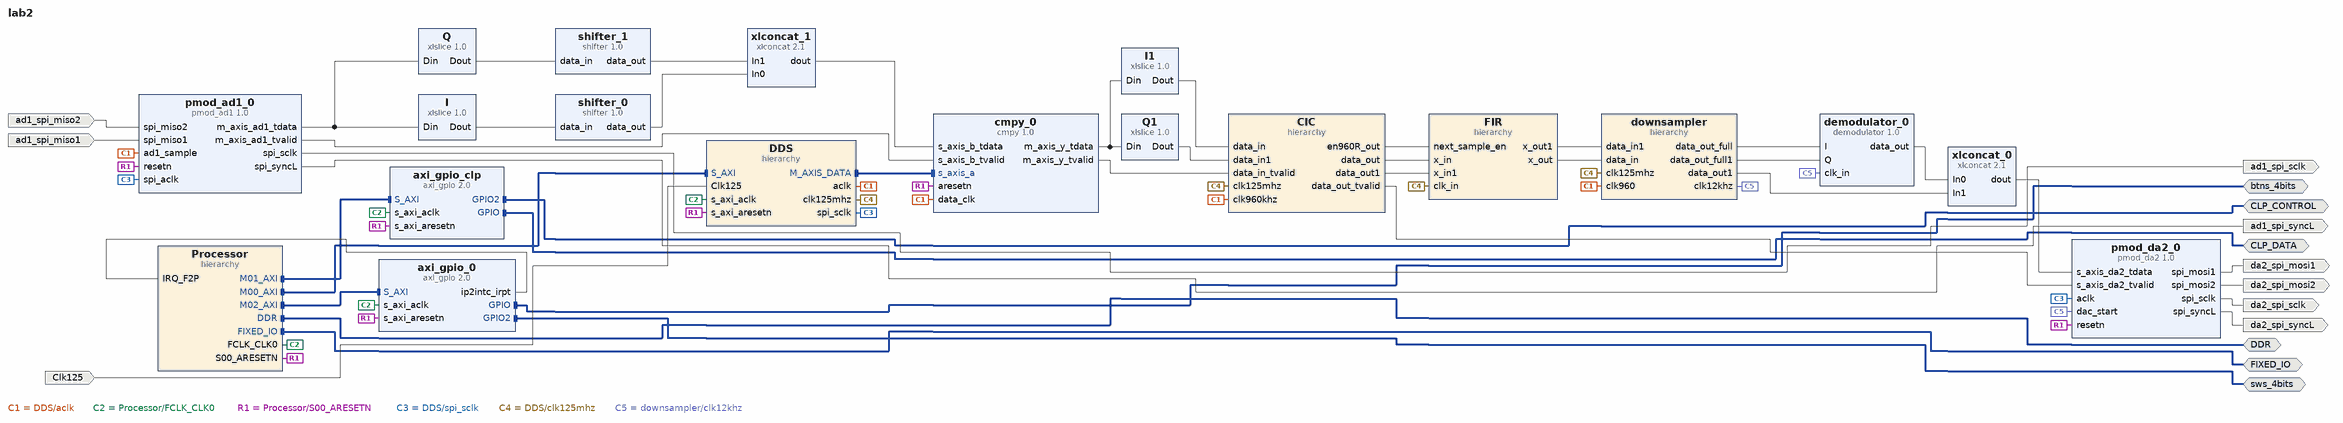
[diagram p0: block diagram of the top level]
# Vivado block design lab2, Vivado 2016.1
create_bd_design lab2

create_bd_intf_port -mode Master -vlnv xilinx.com:interface:ddrx_rtl:1.0 DDR
create_bd_intf_port -mode Master -vlnv xilinx.com:display_processing_system7:fixedio_rtl:1.0 FIXED_IO
create_bd_intf_port -mode Master -vlnv xilinx.com:interface:gpio_rtl:1.0 CLP_CONTROL
create_bd_intf_port -mode Master -vlnv xilinx.com:interface:gpio_rtl:1.0 CLP_DATA
create_bd_intf_port -mode Master -vlnv xilinx.com:interface:gpio_rtl:1.0 btns_4bits
create_bd_intf_port -mode Master -vlnv xilinx.com:interface:gpio_rtl:1.0 sws_4bits
create_bd_port -dir I Clk125
create_bd_port -dir O da2_spi_sclk
create_bd_port -dir O da2_spi_syncL
create_bd_port -dir O da2_spi_mosi1
create_bd_port -dir O da2_spi_mosi2
create_bd_port -dir I ad1_spi_miso2
create_bd_port -dir I ad1_spi_miso1
create_bd_port -dir O ad1_spi_sclk
create_bd_port -dir O ad1_spi_syncL

create_bd_cell -type ip -vlnv dartmouth.edu:user:pmod_da2:1.0 pmod_da2_0
create_bd_cell -type hier Processor
create_bd_cell -type hier DDS
create_bd_cell -type ip -vlnv xilinx.com:ip:axi_gpio:2.0 axi_gpio_clp
set_property -dict [list \
  CONFIG.C_GPIO_WIDTH 8 \
  CONFIG.C_GPIO2_WIDTH 4 \
  CONFIG.C_IS_DUAL 1 \
  CONFIG.C_ALL_OUTPUTS_2 1 \
] [get_bd_cells axi_gpio_clp]
create_bd_cell -type ip -vlnv xilinx.com:ip:axi_gpio:2.0 axi_gpio_0
set_property -dict [list \
  CONFIG.C_INTERRUPT_PRESENT 1 \
  CONFIG.USE_BOARD_FLOW true \
  CONFIG.GPIO_BOARD_INTERFACE btns_4bits \
  CONFIG.GPIO2_BOARD_INTERFACE sws_4bits \
] [get_bd_cells axi_gpio_0]
create_bd_cell -type ip -vlnv dartmouth.edu:user:pmod_ad1:1.0 pmod_ad1_0
create_bd_cell -type ip -vlnv dartmouth.edu:user:cmpy:1.0 cmpy_0
set_property -dict {CONFIG.B_WIDTH 16 CONFIG.Y_WIDTH 16 CONFIG.Y_TDATA_WIDTH 32} [get_bd_cells cmpy_0]
create_bd_cell -type ip -vlnv xilinx.com:ip:xlslice:1.0 I1
set_property -dict {CONFIG.DOUT_WIDTH 16 CONFIG.DIN_FROM 15} [get_bd_cells I1]
create_bd_cell -type ip -vlnv xilinx.com:ip:xlslice:1.0 Q1
set_property -dict {CONFIG.DOUT_WIDTH 16 CONFIG.DIN_TO 16 CONFIG.DIN_FROM 31} [get_bd_cells Q1]
create_bd_cell -type hier CIC
create_bd_cell -type hier FIR
create_bd_cell -type hier downsampler
create_bd_cell -type ip -vlnv xilinx.com:ip:xlconcat:2.1 xlconcat_0
set_property -dict {CONFIG.IN0_WIDTH 16 CONFIG.IN1_WIDTH 16} [get_bd_cells xlconcat_0]
create_bd_cell -type ip -vlnv xilinx.com:ip:xlslice:1.0 I
set_property -dict {CONFIG.DOUT_WIDTH 16 CONFIG.DIN_FROM 15} [get_bd_cells I]
create_bd_cell -type ip -vlnv xilinx.com:ip:xlslice:1.0 Q
set_property -dict {CONFIG.DOUT_WIDTH 16 CONFIG.DIN_TO 16 CONFIG.DIN_FROM 31} [get_bd_cells Q]
create_bd_cell -type ip -vlnv xilinx.com:ip:xlconcat:2.1 xlconcat_1
set_property -dict {CONFIG.IN0_WIDTH 16 CONFIG.IN1_WIDTH 16} [get_bd_cells xlconcat_1]
create_bd_cell -type ip -vlnv dartmouth.edu:user:shifter:1.0 shifter_0
create_bd_cell -type ip -vlnv dartmouth.edu:user:shifter:1.0 shifter_1
create_bd_cell -type ip -vlnv dartmouth.edu:user:demodulator:1.0 demodulator_0

# ---- hierarchy /Processor ----
current_bd_instance /Processor
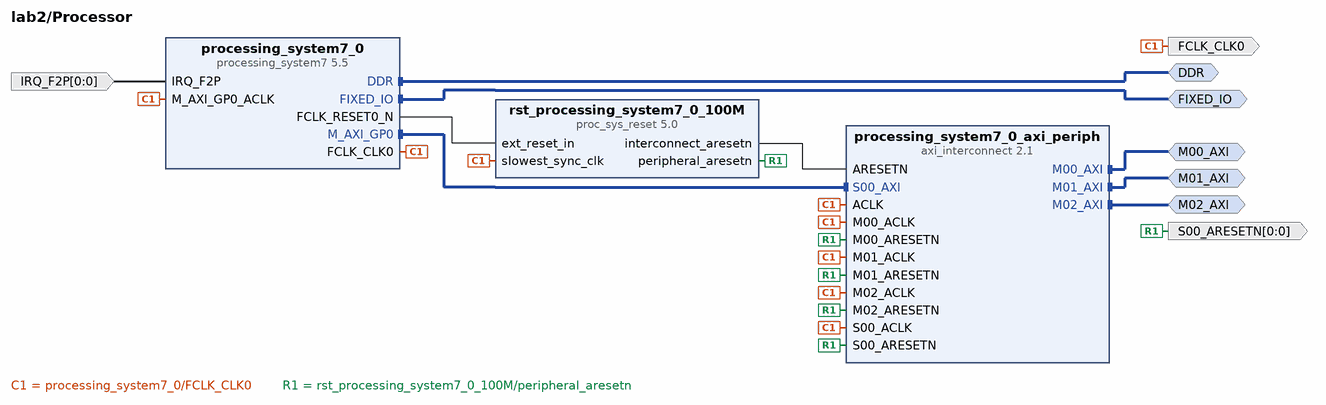
[diagram p1: block diagram inside /Processor]
create_bd_intf_pin -mode Master -vlnv xilinx.com:interface:ddrx_rtl:1.0 DDR
create_bd_intf_pin -mode Master -vlnv xilinx.com:display_processing_system7:fixedio_rtl:1.0 FIXED_IO
create_bd_intf_pin -mode Master -vlnv xilinx.com:interface:aximm_rtl:1.0 M00_AXI
create_bd_intf_pin -mode Master -vlnv xilinx.com:interface:aximm_rtl:1.0 M01_AXI
create_bd_intf_pin -mode Master -vlnv xilinx.com:interface:aximm_rtl:1.0 M02_AXI
create_bd_pin -dir O -type clk FCLK_CLK0
create_bd_pin -dir O -from 0 -to 0 -type rst S00_ARESETN
create_bd_pin -dir I -from 0 -to 0 -type intr IRQ_F2P

create_bd_cell -type ip -vlnv xilinx.com:ip:processing_system7:5.5 processing_system7_0
set_property -dict [list \
  CONFIG.PCW_UIPARAM_DDR_FREQ_MHZ 525 \
  CONFIG.PCW_CRYSTAL_PERIPHERAL_FREQMHZ 50.000000 \
  CONFIG.PCW_APU_PERIPHERAL_FREQMHZ 650 \
  CONFIG.PCW_SDIO_PERIPHERAL_FREQMHZ 50 \
  CONFIG.PCW_FPGA0_PERIPHERAL_FREQMHZ 100 \
  CONFIG.PCW_USE_FABRIC_INTERRUPT 1 \
  CONFIG.PCW_IRQ_F2P_INTR 1 \
  CONFIG.PCW_PRESET_BANK1_VOLTAGE {LVCMOS 1.8V} \
  CONFIG.PCW_UIPARAM_DDR_PARTNO {MT41K128M16 JT-125} \
  CONFIG.PCW_QSPI_PERIPHERAL_ENABLE 1 \
  CONFIG.PCW_QSPI_GRP_SINGLE_SS_ENABLE 1 \
  CONFIG.PCW_QSPI_GRP_FBCLK_ENABLE 1 \
  CONFIG.PCW_ENET0_PERIPHERAL_ENABLE 1 \
  CONFIG.PCW_ENET0_ENET0_IO {MIO 16 .. 27} \
  CONFIG.PCW_ENET0_GRP_MDIO_ENABLE 1 \
  CONFIG.PCW_ENET0_RESET_ENABLE 0 \
  CONFIG.PCW_SD0_PERIPHERAL_ENABLE 1 \
  CONFIG.PCW_SD0_GRP_CD_ENABLE 1 \
  CONFIG.PCW_SD0_GRP_CD_IO {MIO 47} \
  CONFIG.PCW_SD0_GRP_WP_ENABLE 1 \
  CONFIG.PCW_UART1_PERIPHERAL_ENABLE 1 \
  CONFIG.PCW_TTC0_PERIPHERAL_ENABLE 1 \
  CONFIG.PCW_USB0_PERIPHERAL_ENABLE 1 \
  CONFIG.PCW_USB0_RESET_ENABLE 1 \
  CONFIG.PCW_USB0_RESET_IO {MIO 46} \
  CONFIG.PCW_GPIO_MIO_GPIO_ENABLE 1 \
] [get_bd_cells processing_system7_0]
# 105 more settings of processing_system7_0 are not shown: defaults, MIO pin electricals, DDR timing, and values the tool derives
create_bd_cell -type ip -vlnv xilinx.com:ip:proc_sys_reset:5.0 rst_processing_system7_0_100M
create_bd_cell -type ip -vlnv xilinx.com:ip:axi_interconnect:2.1 processing_system7_0_axi_periph
set_property -dict {CONFIG.NUM_MI 3} [get_bd_cells processing_system7_0_axi_periph]

# ---- hierarchy /DDS ----
current_bd_instance /DDS
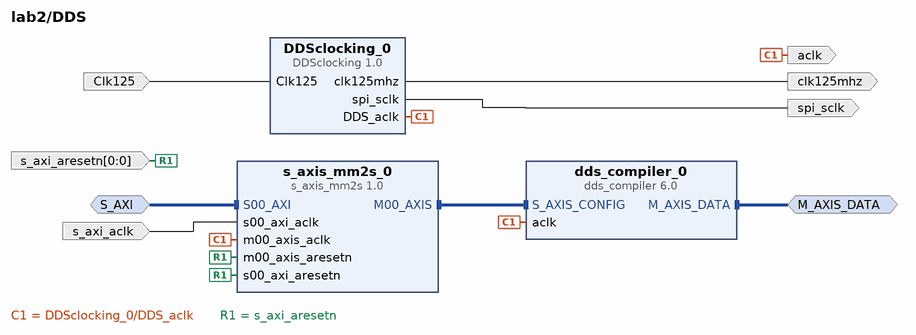
[diagram p2: block diagram inside /DDS]
create_bd_intf_pin -mode Master -vlnv xilinx.com:interface:axis_rtl:1.0 M_AXIS_DATA
create_bd_intf_pin -mode Slave -vlnv xilinx.com:interface:aximm_rtl:1.0 S_AXI
create_bd_pin -dir I Clk125
create_bd_pin -dir O spi_sclk
create_bd_pin -dir O -type clk aclk
create_bd_pin -dir I -type clk s_axi_aclk
create_bd_pin -dir I -from 0 -to 0 -type rst s_axi_aresetn
create_bd_pin -dir O clk125mhz

create_bd_cell -type ip -vlnv xilinx.com:ip:dds_compiler:6.0 dds_compiler_0
set_property -dict [list \
  CONFIG.DDS_Clock_Rate .96 \
  CONFIG.Parameter_Entry Hardware_Parameters \
  CONFIG.Spurious_Free_Dynamic_Range 45 \
  CONFIG.Frequency_Resolution 0.4 \
  CONFIG.Noise_Shaping None \
  CONFIG.Phase_Width 32 \
  CONFIG.Output_Width 12 \
  CONFIG.Phase_Increment Programmable \
  CONFIG.Negative_Sine true \
  CONFIG.Has_Phase_Out false \
  CONFIG.DATA_Has_TLAST Not_Required \
  CONFIG.Has_TREADY false \
  CONFIG.S_PHASE_Has_TUSER Not_Required \
  CONFIG.M_DATA_Has_TUSER Not_Required \
  CONFIG.Latency 7 \
  CONFIG.Output_Frequency1 0 \
  CONFIG.PINC1 10101010101010 \
] [get_bd_cells dds_compiler_0]
create_bd_cell -type ip -vlnv dartmouth.edu:user:s_axis_mm2s:1.0 s_axis_mm2s_0
create_bd_cell -type ip -vlnv dartmouth.edu:user:DDSclocking:1.0 DDSclocking_0

# ---- hierarchy /CIC ----
current_bd_instance /CIC
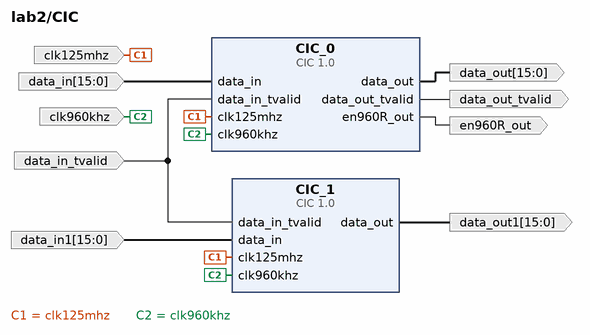
[diagram p3: block diagram inside /CIC]
create_bd_pin -dir I -from 15 -to 0 data_in
create_bd_pin -dir I -from 15 -to 0 data_in1
create_bd_pin -dir I data_in_tvalid
create_bd_pin -dir I clk125mhz
create_bd_pin -dir I clk960khz
create_bd_pin -dir O en960R_out
create_bd_pin -dir O -from 15 -to 0 data_out
create_bd_pin -dir O -from 15 -to 0 data_out1
create_bd_pin -dir O data_out_tvalid

create_bd_cell -type ip -vlnv dartmouth.edu:user:CIC:1.0 CIC_1
create_bd_cell -type ip -vlnv dartmouth.edu:user:CIC:1.0 CIC_0

# ---- hierarchy /FIR ----
current_bd_instance /FIR
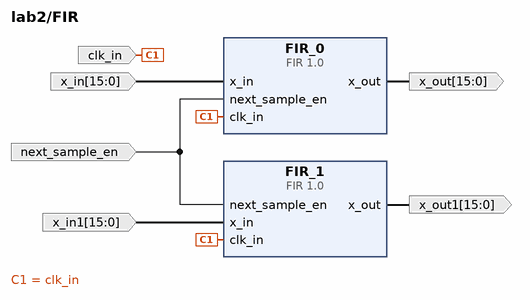
[diagram p4: block diagram inside /FIR]
create_bd_pin -dir I next_sample_en
create_bd_pin -dir I -from 15 -to 0 x_in
create_bd_pin -dir I clk_in
create_bd_pin -dir I -from 15 -to 0 x_in1
create_bd_pin -dir O -from 15 -to 0 x_out
create_bd_pin -dir O -from 15 -to 0 x_out1

create_bd_cell -type ip -vlnv dartmouth.edu:user:FIR:1.0 FIR_0
set_property -dict {CONFIG.DATA_OUT_WIDTH 16} [get_bd_cells FIR_0]
create_bd_cell -type ip -vlnv dartmouth.edu:user:FIR:1.0 FIR_1
set_property -dict {CONFIG.DATA_OUT_WIDTH 16} [get_bd_cells FIR_1]

# ---- hierarchy /downsampler ----
current_bd_instance /downsampler
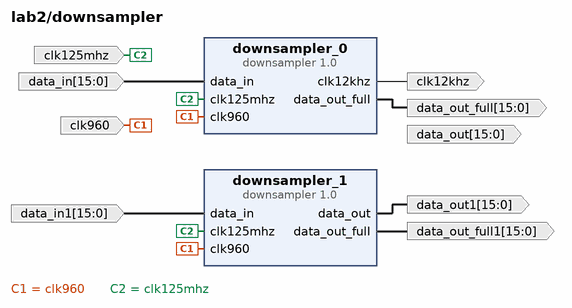
[diagram p5: block diagram inside /downsampler]
create_bd_pin -dir I -from 15 -to 0 data_in
create_bd_pin -dir I clk960
create_bd_pin -dir I clk125mhz
create_bd_pin -dir I -from 15 -to 0 data_in1
create_bd_pin -dir O -from 15 -to 0 data_out
create_bd_pin -dir O -from 15 -to 0 data_out1
create_bd_pin -dir O clk12khz
create_bd_pin -dir O -from 15 -to 0 data_out_full
create_bd_pin -dir O -from 15 -to 0 data_out_full1

create_bd_cell -type ip -vlnv dartmouth.edu:user:downsampler:1.0 downsampler_0
create_bd_cell -type ip -vlnv dartmouth.edu:user:downsampler:1.0 downsampler_1

# ---- connections ----

current_bd_instance /Processor
connect_bd_intf_net [get_bd_intf_pins processing_system7_0/M_AXI_GP0] [get_bd_intf_pins processing_system7_0_axi_periph/S00_AXI]
connect_bd_intf_net [get_bd_intf_pins DDR] [get_bd_intf_pins processing_system7_0/DDR]
connect_bd_intf_net [get_bd_intf_pins FIXED_IO] [get_bd_intf_pins processing_system7_0/FIXED_IO]
connect_bd_intf_net [get_bd_intf_pins M00_AXI] [get_bd_intf_pins processing_system7_0_axi_periph/M00_AXI]
connect_bd_intf_net [get_bd_intf_pins M01_AXI] [get_bd_intf_pins processing_system7_0_axi_periph/M01_AXI]
connect_bd_intf_net [get_bd_intf_pins M02_AXI] [get_bd_intf_pins processing_system7_0_axi_periph/M02_AXI]
connect_bd_net [get_bd_pins processing_system7_0/FCLK_RESET0_N] [get_bd_pins rst_processing_system7_0_100M/ext_reset_in]
connect_bd_net [get_bd_pins rst_processing_system7_0_100M/interconnect_aresetn] [get_bd_pins processing_system7_0_axi_periph/ARESETN]
connect_bd_net [get_bd_pins processing_system7_0/FCLK_CLK0] \
  [get_bd_pins FCLK_CLK0] [get_bd_pins rst_processing_system7_0_100M/slowest_sync_clk] \
  [get_bd_pins processing_system7_0/M_AXI_GP0_ACLK] [get_bd_pins processing_system7_0_axi_periph/S00_ACLK] \
  [get_bd_pins processing_system7_0_axi_periph/ACLK] [get_bd_pins processing_system7_0_axi_periph/M00_ACLK] \
  [get_bd_pins processing_system7_0_axi_periph/M01_ACLK] [get_bd_pins processing_system7_0_axi_periph/M02_ACLK]
connect_bd_net [get_bd_pins rst_processing_system7_0_100M/peripheral_aresetn] \
  [get_bd_pins S00_ARESETN] [get_bd_pins processing_system7_0_axi_periph/S00_ARESETN] \
  [get_bd_pins processing_system7_0_axi_periph/M00_ARESETN] [get_bd_pins processing_system7_0_axi_periph/M01_ARESETN] \
  [get_bd_pins processing_system7_0_axi_periph/M02_ARESETN]
connect_bd_net [get_bd_pins IRQ_F2P] [get_bd_pins processing_system7_0/IRQ_F2P]

current_bd_instance /DDS
connect_bd_intf_net [get_bd_intf_pins s_axis_mm2s_0/M00_AXIS] [get_bd_intf_pins dds_compiler_0/S_AXIS_CONFIG]
connect_bd_intf_net [get_bd_intf_pins M_AXIS_DATA] [get_bd_intf_pins dds_compiler_0/M_AXIS_DATA]
connect_bd_intf_net [get_bd_intf_pins S_AXI] [get_bd_intf_pins s_axis_mm2s_0/S00_AXI]
connect_bd_net [get_bd_pins DDSclocking_0/DDS_aclk] [get_bd_pins aclk] [get_bd_pins dds_compiler_0/aclk] [get_bd_pins s_axis_mm2s_0/m00_axis_aclk]
connect_bd_net [get_bd_pins s_axi_aresetn] [get_bd_pins s_axis_mm2s_0/m00_axis_aresetn] [get_bd_pins s_axis_mm2s_0/s00_axi_aresetn]
connect_bd_net [get_bd_pins s_axi_aclk] [get_bd_pins s_axis_mm2s_0/s00_axi_aclk]
connect_bd_net -net Clk125_1 [get_bd_pins Clk125] [get_bd_pins DDSclocking_0/Clk125]
connect_bd_net [get_bd_pins DDSclocking_0/spi_sclk] [get_bd_pins spi_sclk]
connect_bd_net [get_bd_pins DDSclocking_0/clk125mhz] [get_bd_pins clk125mhz]

current_bd_instance /CIC
connect_bd_net [get_bd_pins data_in] [get_bd_pins CIC_0/data_in]
connect_bd_net -net data_in1_1 [get_bd_pins data_in1] [get_bd_pins CIC_1/data_in]
connect_bd_net [get_bd_pins data_in_tvalid] [get_bd_pins CIC_1/data_in_tvalid] [get_bd_pins CIC_0/data_in_tvalid]
connect_bd_net [get_bd_pins clk125mhz] [get_bd_pins CIC_1/clk125mhz] [get_bd_pins CIC_0/clk125mhz]
connect_bd_net [get_bd_pins clk960khz] [get_bd_pins CIC_1/clk960khz] [get_bd_pins CIC_0/clk960khz]
connect_bd_net [get_bd_pins CIC_0/en960R_out] [get_bd_pins en960R_out]
connect_bd_net [get_bd_pins CIC_0/data_out] [get_bd_pins data_out]
connect_bd_net [get_bd_pins CIC_1/data_out] [get_bd_pins data_out1]
connect_bd_net [get_bd_pins CIC_0/data_out_tvalid] [get_bd_pins data_out_tvalid]

current_bd_instance /FIR
connect_bd_net [get_bd_pins next_sample_en] [get_bd_pins FIR_0/next_sample_en] [get_bd_pins FIR_1/next_sample_en]
connect_bd_net [get_bd_pins x_in] [get_bd_pins FIR_0/x_in]
connect_bd_net [get_bd_pins clk_in] [get_bd_pins FIR_0/clk_in] [get_bd_pins FIR_1/clk_in]
connect_bd_net [get_bd_pins FIR_0/x_out] [get_bd_pins x_out]
connect_bd_net -net x_in1_1 [get_bd_pins x_in1] [get_bd_pins FIR_1/x_in]
connect_bd_net [get_bd_pins FIR_1/x_out] [get_bd_pins x_out1]

current_bd_instance /downsampler
connect_bd_net [get_bd_pins data_in] [get_bd_pins downsampler_0/data_in]
connect_bd_net -net clk960_1 [get_bd_pins clk960] [get_bd_pins downsampler_0/clk960] [get_bd_pins downsampler_1/clk960]
connect_bd_net [get_bd_pins clk125mhz] [get_bd_pins downsampler_0/clk125mhz] [get_bd_pins downsampler_1/clk125mhz]
connect_bd_net -net data_in1_1 [get_bd_pins data_in1] [get_bd_pins downsampler_1/data_in]
connect_bd_net [get_bd_pins downsampler_0/clk12khz] [get_bd_pins clk12khz]
connect_bd_net [get_bd_pins downsampler_0/data_out_full] [get_bd_pins data_out_full]
connect_bd_net [get_bd_pins downsampler_1/data_out] [get_bd_pins data_out1]
connect_bd_net [get_bd_pins downsampler_1/data_out_full] [get_bd_pins data_out_full1]

current_bd_instance /
connect_bd_intf_net [get_bd_intf_pins Processor/M00_AXI] [get_bd_intf_pins DDS/S_AXI]
connect_bd_intf_net [get_bd_intf_pins axi_gpio_clp/S_AXI] [get_bd_intf_pins Processor/M01_AXI]
connect_bd_intf_net [get_bd_intf_pins axi_gpio_0/S_AXI] [get_bd_intf_pins Processor/M02_AXI]
connect_bd_intf_net [get_bd_intf_pins DDS/M_AXIS_DATA] [get_bd_intf_pins cmpy_0/s_axis_a]
connect_bd_intf_net -intf_net processing_system7_0_DDR [get_bd_intf_ports DDR] [get_bd_intf_pins Processor/DDR]
connect_bd_intf_net -intf_net processing_system7_0_FIXED_IO [get_bd_intf_ports FIXED_IO] [get_bd_intf_pins Processor/FIXED_IO]
connect_bd_intf_net -intf_net axi_gpio_0_GPIO2 [get_bd_intf_ports CLP_CONTROL] [get_bd_intf_pins axi_gpio_clp/GPIO2]
connect_bd_intf_net -intf_net axi_gpio_0_GPIO [get_bd_intf_ports CLP_DATA] [get_bd_intf_pins axi_gpio_clp/GPIO]
connect_bd_intf_net [get_bd_intf_ports btns_4bits] [get_bd_intf_pins axi_gpio_0/GPIO]
connect_bd_intf_net [get_bd_intf_ports sws_4bits] [get_bd_intf_pins axi_gpio_0/GPIO2]
connect_bd_net -net Clk125_1 [get_bd_ports Clk125] [get_bd_pins DDS/Clk125]
connect_bd_net -net DDSclocking_0_DDS_aclk [get_bd_pins DDS/aclk] \
  [get_bd_pins pmod_ad1_0/ad1_sample] [get_bd_pins cmpy_0/data_clk] [get_bd_pins CIC/clk960khz] \
  [get_bd_pins downsampler/clk960]
connect_bd_net -net processing_system7_0_FCLK_CLK0 [get_bd_pins Processor/FCLK_CLK0] \
  [get_bd_pins axi_gpio_clp/s_axi_aclk] [get_bd_pins axi_gpio_0/s_axi_aclk] [get_bd_pins DDS/s_axi_aclk]
connect_bd_net -net rst_processing_system7_0_100M_peripheral_aresetn [get_bd_pins Processor/S00_ARESETN] \
  [get_bd_pins pmod_da2_0/resetn] [get_bd_pins axi_gpio_clp/s_axi_aresetn] [get_bd_pins axi_gpio_0/s_axi_aresetn] \
  [get_bd_pins pmod_ad1_0/resetn] [get_bd_pins cmpy_0/aresetn] [get_bd_pins DDS/s_axi_aresetn]
connect_bd_net -net DDSclocking_0_spi_sclk [get_bd_pins DDS/spi_sclk] [get_bd_pins pmod_da2_0/aclk] [get_bd_pins pmod_ad1_0/spi_aclk]
connect_bd_net [get_bd_pins pmod_da2_0/spi_sclk] [get_bd_ports da2_spi_sclk]
connect_bd_net [get_bd_pins pmod_da2_0/spi_syncL] [get_bd_ports da2_spi_syncL]
connect_bd_net [get_bd_pins pmod_da2_0/spi_mosi1] [get_bd_ports da2_spi_mosi1]
connect_bd_net [get_bd_pins pmod_da2_0/spi_mosi2] [get_bd_ports da2_spi_mosi2]
connect_bd_net [get_bd_pins axi_gpio_0/ip2intc_irpt] [get_bd_pins Processor/IRQ_F2P]
connect_bd_net -net spi_miso2_1 [get_bd_ports ad1_spi_miso2] [get_bd_pins pmod_ad1_0/spi_miso2]
connect_bd_net -net spi_miso1_1 [get_bd_ports ad1_spi_miso1] [get_bd_pins pmod_ad1_0/spi_miso1]
connect_bd_net [get_bd_pins pmod_ad1_0/spi_sclk] [get_bd_ports ad1_spi_sclk]
connect_bd_net [get_bd_pins pmod_ad1_0/spi_syncL] [get_bd_ports ad1_spi_syncL]
connect_bd_net [get_bd_pins cmpy_0/m_axis_y_tdata] [get_bd_pins I1/Din] [get_bd_pins Q1/Din]
connect_bd_net -net xlslice_0_Dout [get_bd_pins I1/Dout] [get_bd_pins CIC/data_in]
connect_bd_net -net xlslice_1_Dout [get_bd_pins Q1/Dout] [get_bd_pins CIC/data_in1]
connect_bd_net [get_bd_pins cmpy_0/m_axis_y_tvalid] [get_bd_pins CIC/data_in_tvalid]
connect_bd_net -net clk125mhz_1 [get_bd_pins DDS/clk125mhz] [get_bd_pins CIC/clk125mhz] [get_bd_pins FIR/clk_in] [get_bd_pins downsampler/clk125mhz]
connect_bd_net [get_bd_pins CIC/en960R_out] [get_bd_pins FIR/next_sample_en]
connect_bd_net [get_bd_pins CIC/data_out] [get_bd_pins FIR/x_in]
connect_bd_net [get_bd_pins CIC/data_out1] [get_bd_pins FIR/x_in1]
connect_bd_net [get_bd_pins FIR/x_out1] [get_bd_pins downsampler/data_in1]
connect_bd_net [get_bd_pins downsampler/data_out1] [get_bd_pins xlconcat_0/In1]
connect_bd_net [get_bd_pins xlconcat_0/dout] [get_bd_pins pmod_da2_0/s_axis_da2_tdata]
connect_bd_net [get_bd_pins CIC/data_out_tvalid] [get_bd_pins pmod_da2_0/s_axis_da2_tvalid]
connect_bd_net [get_bd_pins downsampler/clk12khz] [get_bd_pins pmod_da2_0/dac_start] [get_bd_pins demodulator_0/clk_in]
connect_bd_net [get_bd_pins pmod_ad1_0/m_axis_ad1_tvalid] [get_bd_pins cmpy_0/s_axis_b_tvalid]
connect_bd_net [get_bd_pins pmod_ad1_0/m_axis_ad1_tdata] [get_bd_pins I/Din] [get_bd_pins Q/Din]
connect_bd_net [get_bd_pins xlconcat_1/dout] [get_bd_pins cmpy_0/s_axis_b_tdata]
connect_bd_net [get_bd_pins I/Dout] [get_bd_pins shifter_0/data_in]
connect_bd_net [get_bd_pins shifter_0/data_out] [get_bd_pins xlconcat_1/In0]
connect_bd_net [get_bd_pins Q/Dout] [get_bd_pins shifter_1/data_in]
connect_bd_net [get_bd_pins shifter_1/data_out] [get_bd_pins xlconcat_1/In1]
connect_bd_net [get_bd_pins FIR/x_out] [get_bd_pins downsampler/data_in]
connect_bd_net [get_bd_pins downsampler/data_out_full] [get_bd_pins demodulator_0/I]
connect_bd_net [get_bd_pins downsampler/data_out_full1] [get_bd_pins demodulator_0/Q]
connect_bd_net [get_bd_pins demodulator_0/data_out] [get_bd_pins xlconcat_0/In0]

# ---- address map ----
assign_bd_address -offset 0x41200000 -range 64K -target_address_space [get_bd_addr_spaces Processor/processing_system7_0/Data] [get_bd_addr_segs axi_gpio_clp/S_AXI/Reg]
assign_bd_address -offset 0x41210000 -range 64K -target_address_space [get_bd_addr_spaces Processor/processing_system7_0/Data] [get_bd_addr_segs axi_gpio_0/S_AXI/Reg]
assign_bd_address -offset 0x43C00000 -range 64K -target_address_space [get_bd_addr_spaces Processor/processing_system7_0/Data] [get_bd_addr_segs DDS/s_axis_mm2s_0/S00_AXI/S00_AXI_reg]

validate_bd_design
save_bd_design
